# Altium schematic sheet Sheet1.SchDoc
size A4
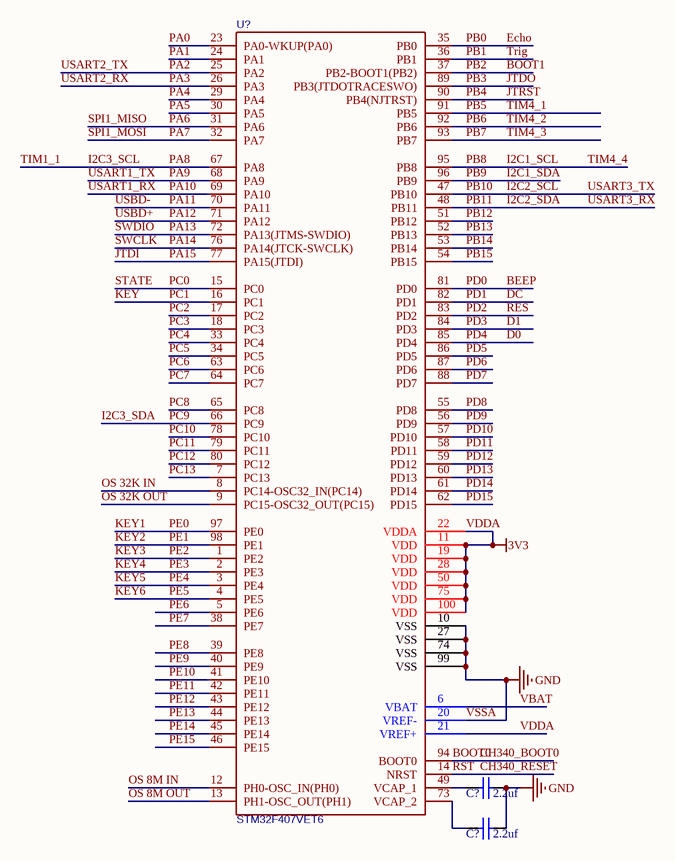
[diagram p0: Sheet1.SchDoc]

## Parts
(Parts that share a designator on the sheet are numbered #1, #2 ... from top to bottom, then left to right.)
C?#1  2.2uf  [C0603]
C?#2  2.2uf  [C0603]
U?  STM32F407VET6  [LQFP100]

## Nets
VDDA: U?.11(VDD) U?.19(VDD) U?.21(VREF+) U?.22(VDDA) U?.28(VDD) U?.50(VDD) U?.75(VDD) U?.100(VDD)  [also labelled 3V3]
VSSA: C?#1.2 C?#2.2 U?.10(VSS) U?.20(VREF-) U?.27(VSS) U?.74(VSS) U?.99(VSS)  [also labelled GND]
BEEP: U?.81(PD0)  [also labelled PD0]
BOOT0: U?.94(BOOT0)  [also labelled CH340_BOOT0]
BOOT1: U?.37(PB2-BOOT1(PB2))  [also labelled PB2]
CH340_RESET: U?.14(NRST)  [also labelled RST]
D0: U?.85(PD4)  [also labelled PD4]
D1: U?.84(PD3)  [also labelled PD3]
DC: U?.82(PD1)  [also labelled PD1]
Echo: U?.35(PB0)  [also labelled PB0]
I2C1_SCL: U?.95(PB8)  [also labelled PB8, TIM4_4]
I2C1_SDA: U?.96(PB9)  [also labelled PB9]
I2C2_SCL: U?.47(PB10)  [also labelled PB10, USART3_TX]
I2C2_SDA: U?.48(PB11)  [also labelled PB11, USART3_RX]
I2C3_SCL: U?.67(PA8)  [also labelled PA8, TIM1_1]
I2C3_SDA: U?.66(PC9)  [also labelled PC9]
JTDI: U?.77(PA15(JTDI))  [also labelled PA15]
JTDO: U?.89(PB3(JTDOTRACESWO))  [also labelled PB3]
JTRST: U?.90(PB4(NJTRST))  [also labelled PB4]
KEY: U?.16(PC1)  [also labelled PC1]
KEY1: U?.97(PE0)  [also labelled PE0]
KEY2: U?.98(PE1)  [also labelled PE1]
KEY3: U?.1(PE2)  [also labelled PE2]
KEY4: U?.2(PE3)  [also labelled PE3]
KEY5: U?.3(PE4)  [also labelled PE4]
KEY6: U?.4(PE5)  [also labelled PE5]
OS 8M IN: U?.12(PH0-OSC_IN(PH0))
OS 8M OUT: U?.13(PH1-OSC_OUT(PH1))
OS 32K IN: U?.8(PC14-OSC32_IN(PC14))
OS 32K OUT: U?.9(PC15-OSC32_OUT(PC15))
PA0: U?.23(PA0-WKUP(PA0))
PA1: U?.24(PA1)
PA2: U?.25(PA2)  [also labelled USART2_TX]
PA3: U?.26(PA3)  [also labelled USART2_RX]
PA4: U?.29(PA4)
PA5: U?.30(PA5)
PA6: U?.31(PA6)  [also labelled SPI1_MISO]
PA7: U?.32(PA7)  [also labelled SPI1_MOSI]
PA9: U?.68(PA9)  [also labelled USART1_TX]
PA10: U?.69(PA10)  [also labelled USART1_RX]
PA11: U?.70(PA11)  [also labelled USBD-]
PA12: U?.71(PA12)  [also labelled USBD+]
PA13: U?.72(PA13(JTMS-SWDIO))  [also labelled SWDIO]
PA14: U?.76(PA14(JTCK-SWCLK))  [also labelled SWCLK]
PB1: U?.36(PB1)  [also labelled Trig]
PB5: U?.91(PB5)  [also labelled TIM4_1]
PB6: U?.92(PB6)  [also labelled TIM4_2]
PB7: U?.93(PB7)  [also labelled TIM4_3]
PB12: U?.51(PB12)
PB13: U?.52(PB13)
PB14: U?.53(PB14)
PB15: U?.54(PB15)
PC0: U?.15(PC0)  [also labelled STATE]
PC2: U?.17(PC2)
PC3: U?.18(PC3)
PC4: U?.33(PC4)
PC5: U?.34(PC5)
PC6: U?.63(PC6)
PC7: U?.64(PC7)
PC8: U?.65(PC8)
PC10: U?.78(PC10)
PC11: U?.79(PC11)
PC12: U?.80(PC12)
PC13: U?.7(PC13)
PD2: U?.83(PD2)  [also labelled RES]
PD5: U?.86(PD5)
PD6: U?.87(PD6)
PD7: U?.88(PD7)
PD8: U?.55(PD8)
PD9: U?.56(PD9)
PD10: U?.57(PD10)
PD11: U?.58(PD11)
PD12: U?.59(PD12)
PD13: U?.60(PD13)
PD14: U?.61(PD14)
PD15: U?.62(PD15)
PE6: U?.5(PE6)
PE7: U?.38(PE7)
PE8: U?.39(PE8)
PE9: U?.40(PE9)
PE10: U?.41(PE10)
PE11: U?.42(PE11)
PE12: U?.43(PE12)
PE13: U?.44(PE13)
PE14: U?.45(PE14)
PE15: U?.46(PE15)
VBAT: U?.6(VBAT)
NetC?#1_1: C?#1.1 U?.49(VCAP_1)
NetC?#2_1: C?#2.1 U?.73(VCAP_2)

## Library data of the parts
C?#1 C?#2 = 电容: Capacitor; Value: 22pF; Published: 8-Jun-2000; LatestRevisionDate: 17-Jul-2002; LatestRevisionNote: Re-released for DXP Platform.; PackageReference: RAD-0.3; Publisher: Altium Limited; PackageDescription: Radial Cap, Thru-Hole; 2 Leads; 0.3 in Pin Spacing
U? = STM32F407VET6: BOM_Manufacturer: STMicroelectronics; SMT Type: Basic; BOM_Supplier: LCSC; BOM_Manufacturer Part: STM32F407VET6; BOM_LCSC Assembly: Yes; image: //image.lceda.cn/szlcsc/C28730.jpg; BOM_Supplier Part: C28730; spicePre: U